# Altium schematic sheet Adapter board.SchDoc
size A4
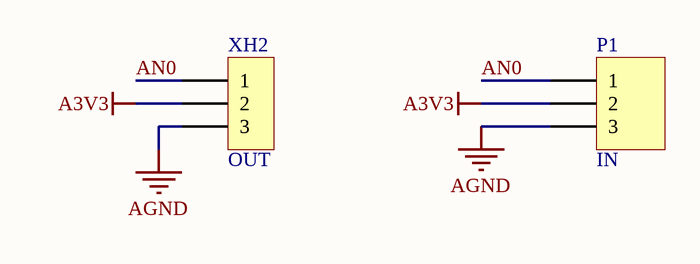
[diagram p0: Adapter board.SchDoc]

## Parts
P1  IN  [HDR1X3]
XH2  OUT  [XH3/2.54mm/180]

## Nets
A3V3: P1.2 XH2.2
AGND: P1.3 XH2.3
AN0: P1.1 XH2.1

## Library data of the parts
P1 = Header 3: Header, 3-Pin; LatestRevisionDate: 17-Jul-2002; LatestRevisionNote: Re-released for DXP Platform.; Publisher: Altium Limited
XH2 = XH3